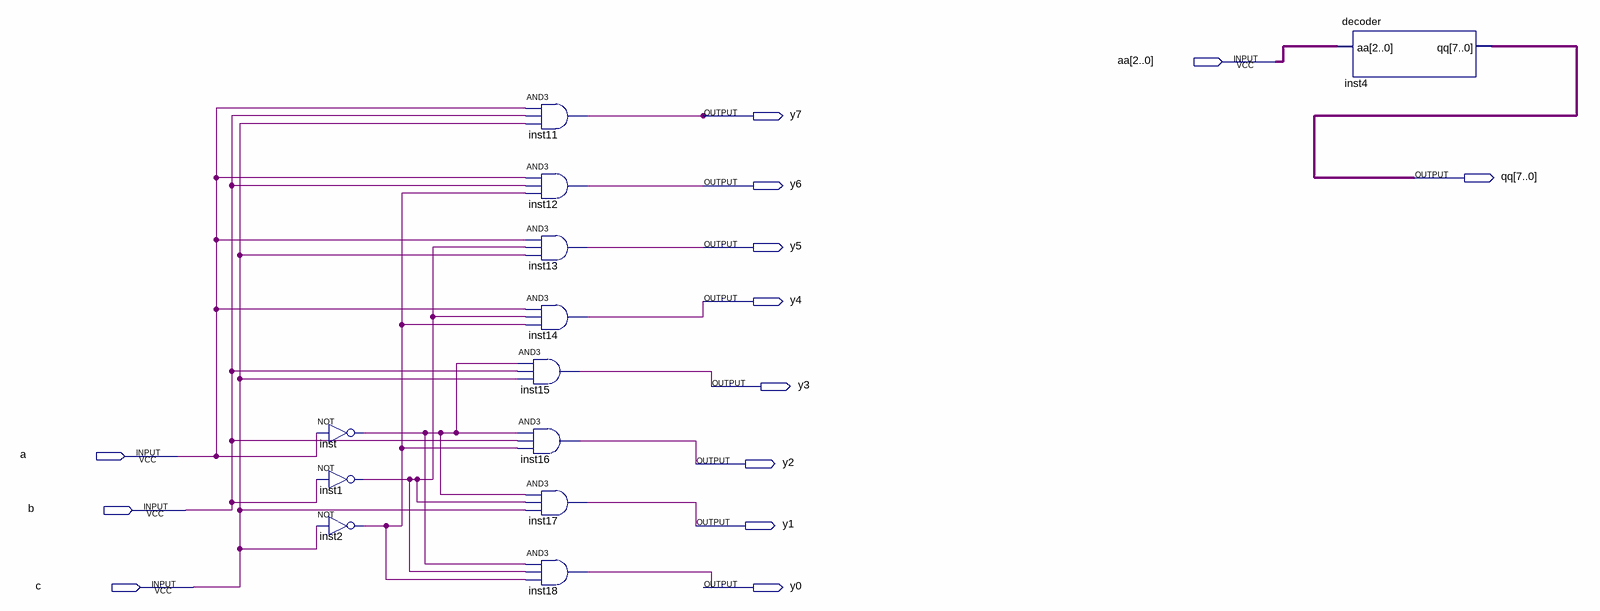
[diagram p0: schematic sheet]
// Quartus schematic e38.bdf as structural Verilog: 12 symbols, 13 pins
module e38 (
  input  [2:0] aa,
  input  a,
  input  b,
  input  c,
  output y7,
  output [7:0] qq,
  output y6,
  output y5,
  output y4,
  output y3,
  output y2,
  output y1,
  output y0
);

  wire inst1_out, inst2_out, inst18_out, inst_out;

  not inst (inst_out, a);
  not inst1 (inst1_out, b);
  not inst2 (inst2_out, c);
  and inst15 (y3, inst_out, b, c);
  and inst16 (y2, inst_out, b, inst2_out);
  and inst11 (y7, a, b, c);
  and inst12 (y6, a, b, inst2_out);
  and inst13 (y5, a, inst1_out, c);
  and inst14 (y4, a, inst1_out, inst2_out);
  and inst17 (y1, inst_out, inst1_out, c);
  and inst18 (inst18_out, inst_out, inst1_out, inst2_out);
  decoder inst4 (.aa(aa), .qq(qq));
endmodule
